# EAGLE design esp32SimpleRelay (EAGLE 8.4.3)
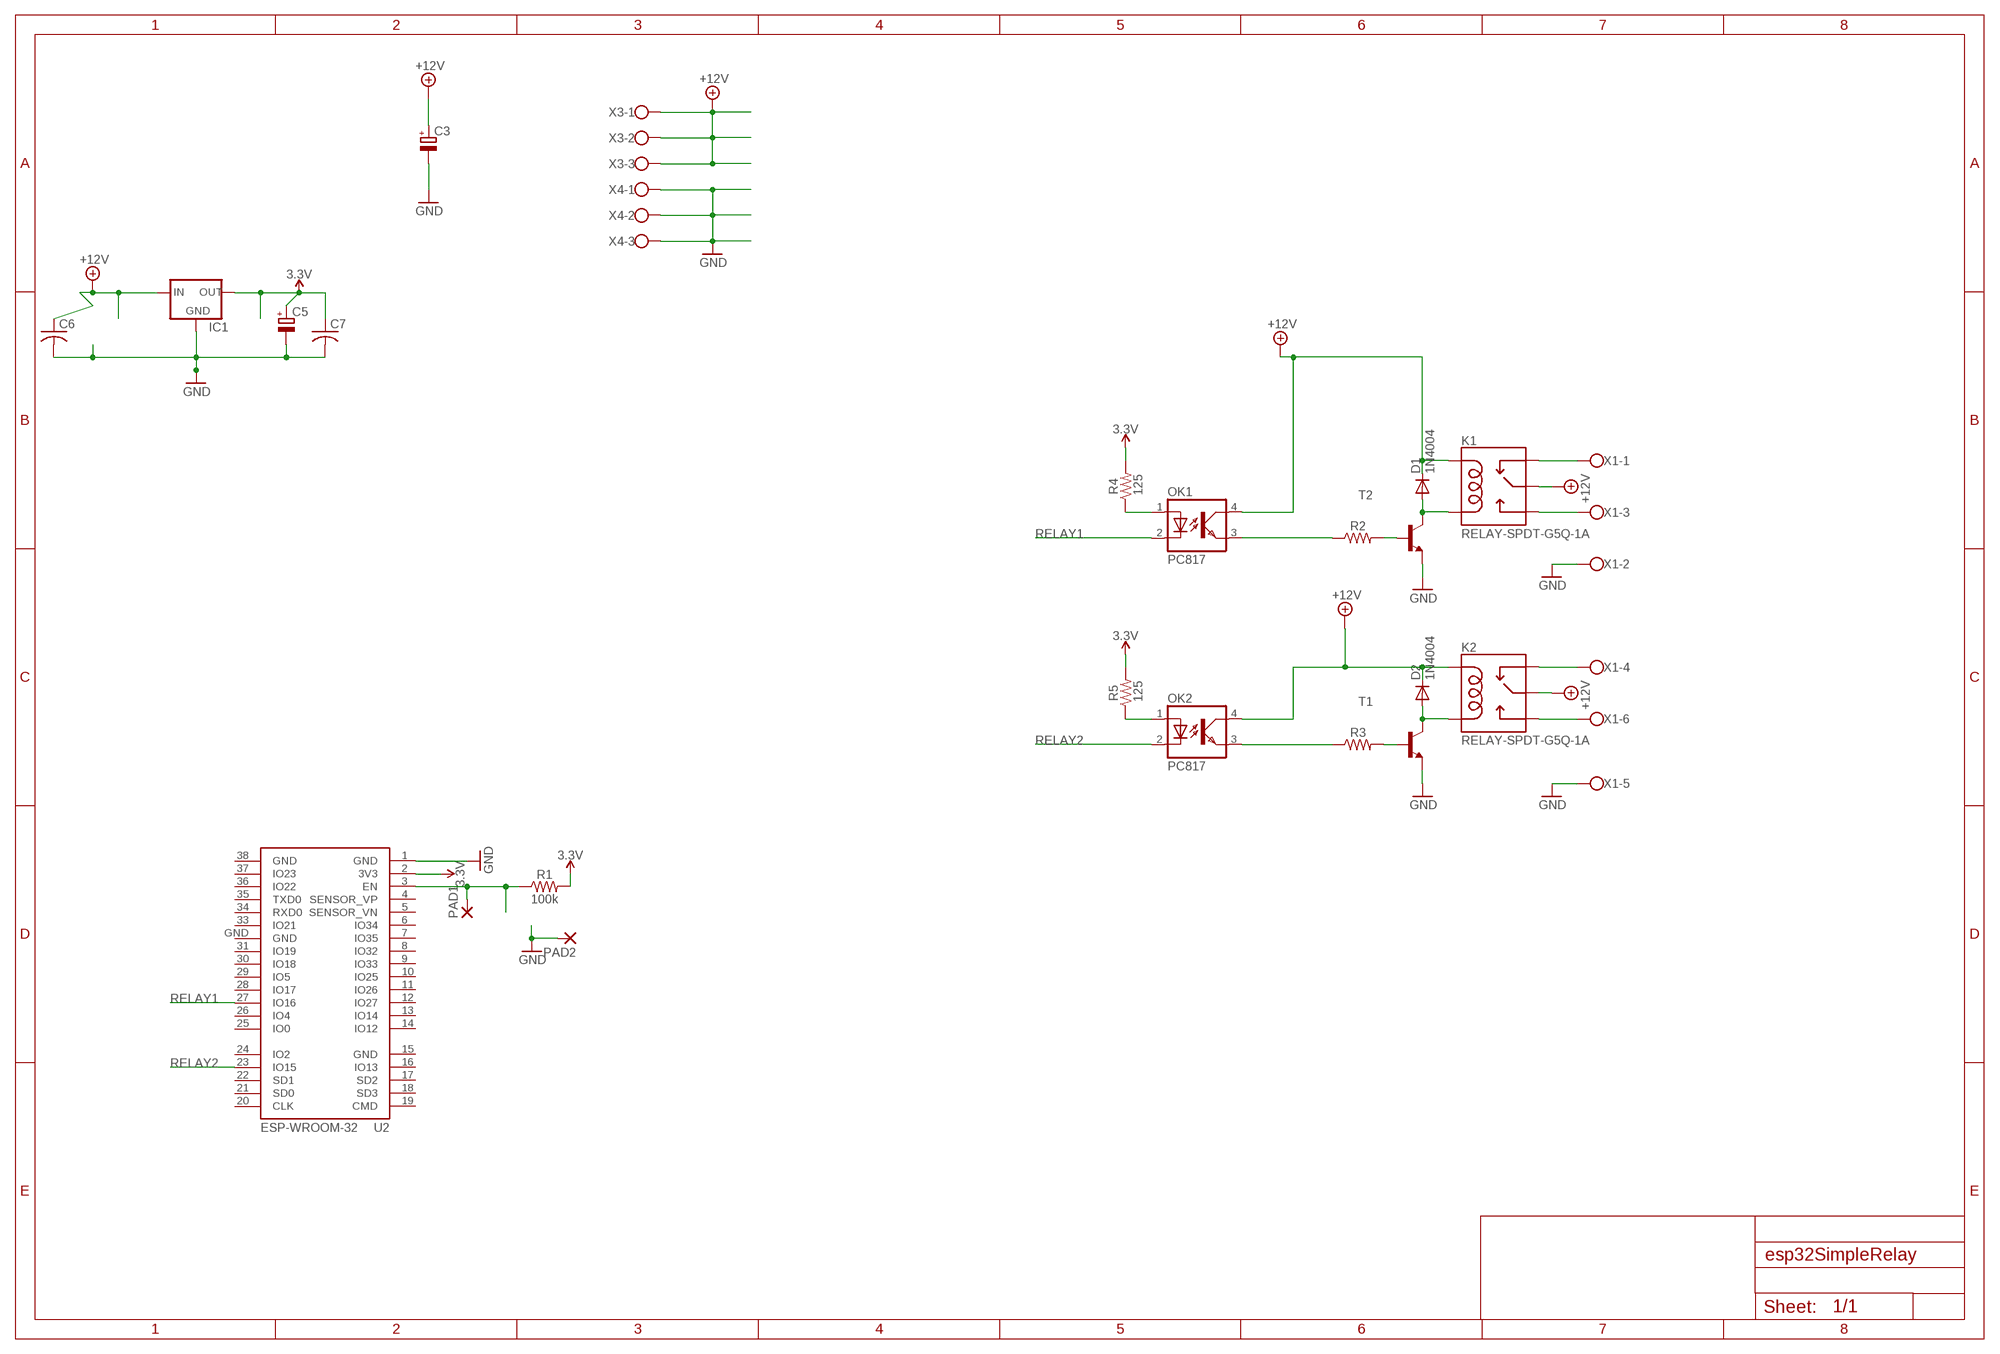
[diagram p0: schematic, sheet 1]

## Parts
C3  CPOL-EUE3.5-8  [E3,5-8]
C5  CPOL-EUE5-6  [E5-6]
C6  C-US050-025X075  [C050-025X075]
C7  C-US050-025X075  [C050-025X075]
D1  1N4004  [DO41-10]
D2  1N4004  [DO41-10]
IC1  78LXX  [78LXX]
K1  RELAY-SPDT-G5Q-1A  [RELAY-G5Q]
K2  RELAY-SPDT-G5Q-1A  [RELAY-G5Q]
OK1  PC817  [DIL04]
OK2  PC817  [DIL04]
PAD1  1,6/0,9  [1,6/0,9]
PAD2  1,6/0,9  [1,6/0,9]
R1  100k  100KOHM-0603-1/10W-1%  [0603]
R2  RESISTORAXIAL-0.3  [AXIAL-0.3]
R3  RESISTORAXIAL-0.3  [AXIAL-0.3]
R4  125  RESISTORAXIAL-0.3  [AXIAL-0.3]
R5  125  RESISTORAXIAL-0.3  [AXIAL-0.3]
T1  -NPN-TO92  [TO92]
T2  -NPN-TO92  [TO92]
U2  ESP-WROOM-32  [ESP-WROOM-32]
X1  W237-6  [W237-6]
X3  W237-103  [W237-103]
X4  W237-103  [W237-103]

## Nets
3.3V: C5.+ C7.1 IC1.OUT R1.2 R4.P$2 R5.P$2 U2.2(3V3)
+12V: C3.+ C6.1 D1.C D2.C IC1.IN K1.2(MAIN) K1.5(COIL1) K2.2(MAIN) K2.5(COIL1) OK1.4(COL) OK2.4(COL) X3.1 X3.2 X3.3
GND: C3.- C5.- C6.2 C7.2 IC1.GND PAD2.1(P) T1.1(E) T2.1(E) U2.1(GND) X1.2 X1.5 X4.1 X4.2 X4.3
N$4: K1.4(NC) X1.1
N$5: K1.3(NO) X1.3
N$6: PAD1.1(P) R1.1 U2.3(EN)
N$7: D1.A K1.1(COIL2) T2.3(C)
N$8: K2.4(NC) X1.4
N$9: D2.A K2.1(COIL2) T1.3(C)
N$10: OK1.1(A) R4.P$1
N$11: K2.3(NO) X1.6
N$12: R2.P$2 T2.2(B)
N$13: OK2.3(EMIT) R3.P$1
N$15: R3.P$2 T1.2(B)
N$16: OK1.3(EMIT) R2.P$1
N$17: OK2.1(A) R5.P$1
RELAY1: OK1.2(C) U2.27(IO16)
RELAY2: OK2.2(C) U2.23(IO15)
Unconnected: U2.4(SENSOR_VP) U2.5(SENSOR_VN) U2.6(IO34) U2.7(IO35) U2.8(IO32) U2.9(IO33) U2.10(IO25) U2.11(IO26) U2.12(IO27) U2.13(IO14) U2.14(IO12) U2.16(IO13) U2.17(SD2) U2.18(SD3) U2.19(CMD) U2.20(CLK) U2.21(SD0) U2.22(SD1) U2.24(IO2) U2.25(IO0) U2.26(IO4) U2.28(IO17) U2.29(IO5) U2.30(IO18) U2.31(IO19) U2.33(IO21) U2.34(RXD0) U2.35(TXD0) U2.36(IO22) U2.37(IO23)

## Power pins joined to a net without a drawn wire
GND: U2.15(GND) U2.38(GND) U2.GND

## Library data of the parts
C3 C5 = resistor:CPOL-EU: POLARIZED CAPACITOR, European symbol
C6 C7 = resistor:C-US: CAPACITOR, American symbol
D1 D2 = diode:1N4004: DIODE general purpose rectifier, 1 A
IC1 = v-reg:78LXX: VOLTAGE REGULATOR
K1 K2 = SparkFun-Retired:RELAY-SPDT: SPDT relay (COM-00101)
OK1 OK2 = optocoupler:PC817: SHARP OPTO COUPLER; MPN: PC817X4J000F; OC_FARNELL: 9707727; OC_NEWARK: 97K7059
PAD1 PAD2 = wirepad:1,6/0,9: THROUGH-HOLE PAD
R1 = SparkFun-Resistors:100KOHM: 100kΩ resistor A resistor is a passive two-terminal electrical component that implements electrical resistance as a circuit element. Resistors act to reduce current flow, and, at the same time, act to lower voltage levels within circuits. - Wikipedia; PROD_ID: RES-07828
R2-R5 = SparkFun-Resistors:RESISTOR: Generic Resistor Package
T1 T2 = transistor-neu-to92:*-NPN-: NPN Transistror
U2 = esp32:ESP-WROOM-32: Espressif Systems ESP-WROOM-32
X1 = con-wago-500:W237-6: WAGO SCREW CLAMP; OC_FARNELL: unknown; OC_NEWARK: unknown
X3 X4 = con-wago-500:W237-103: WAGO SCREW CLAMP; MPN: 237-103; OC_FARNELL: unknown; OC_NEWARK: 18M7116

## Board
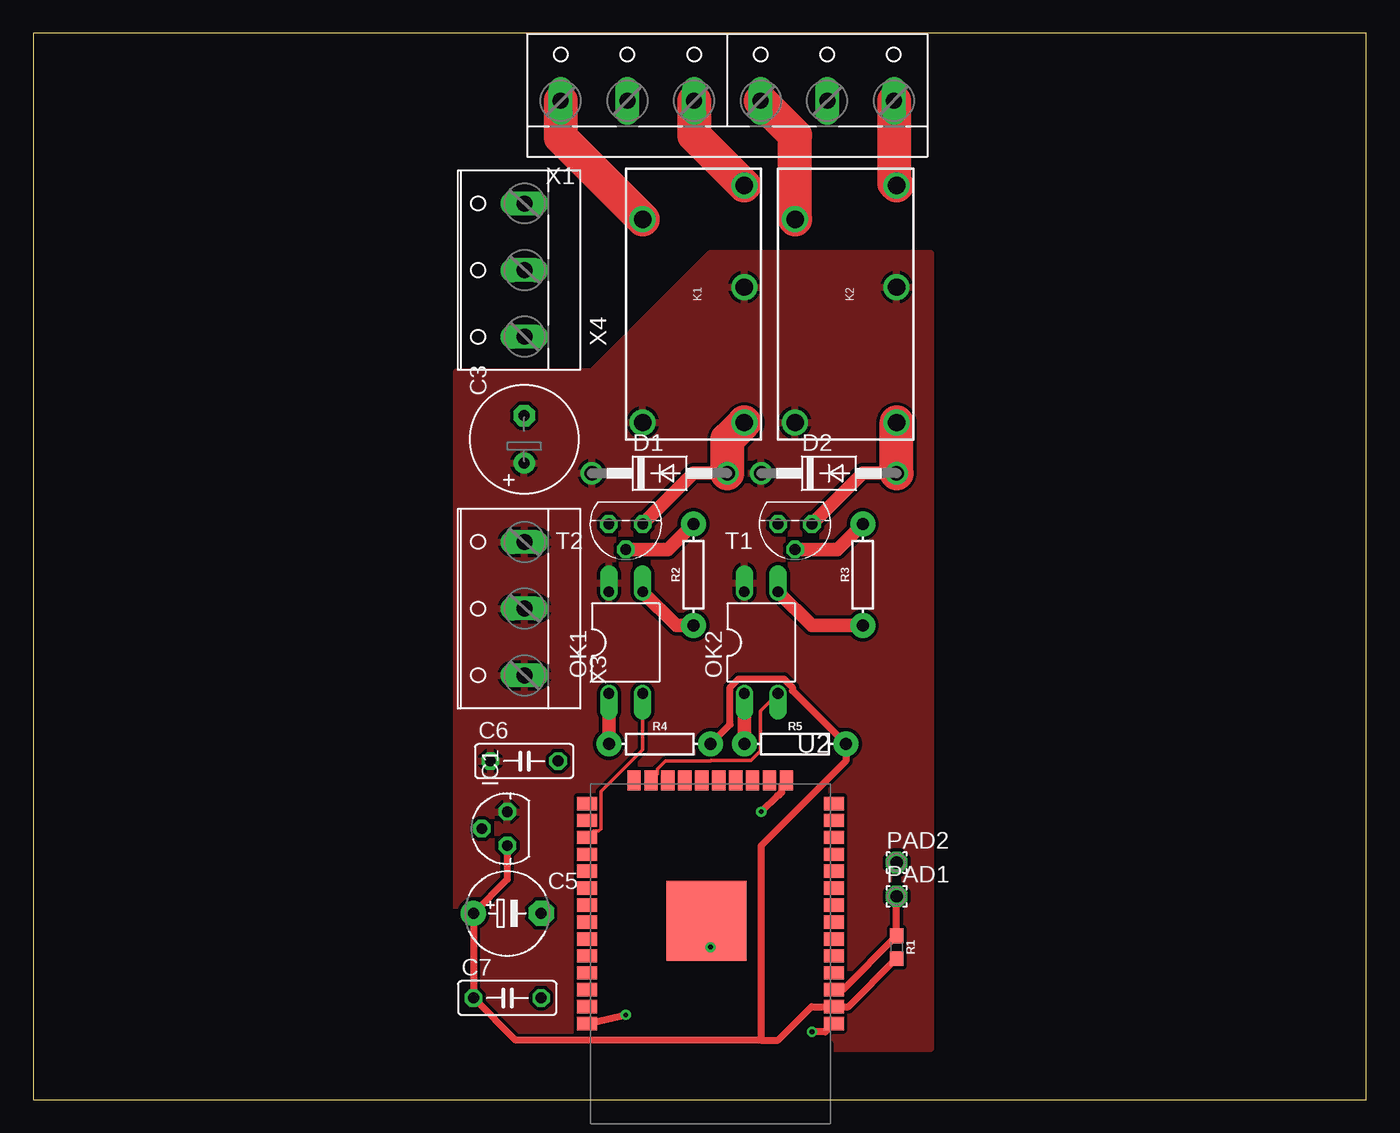
[diagram p1: board, top side]
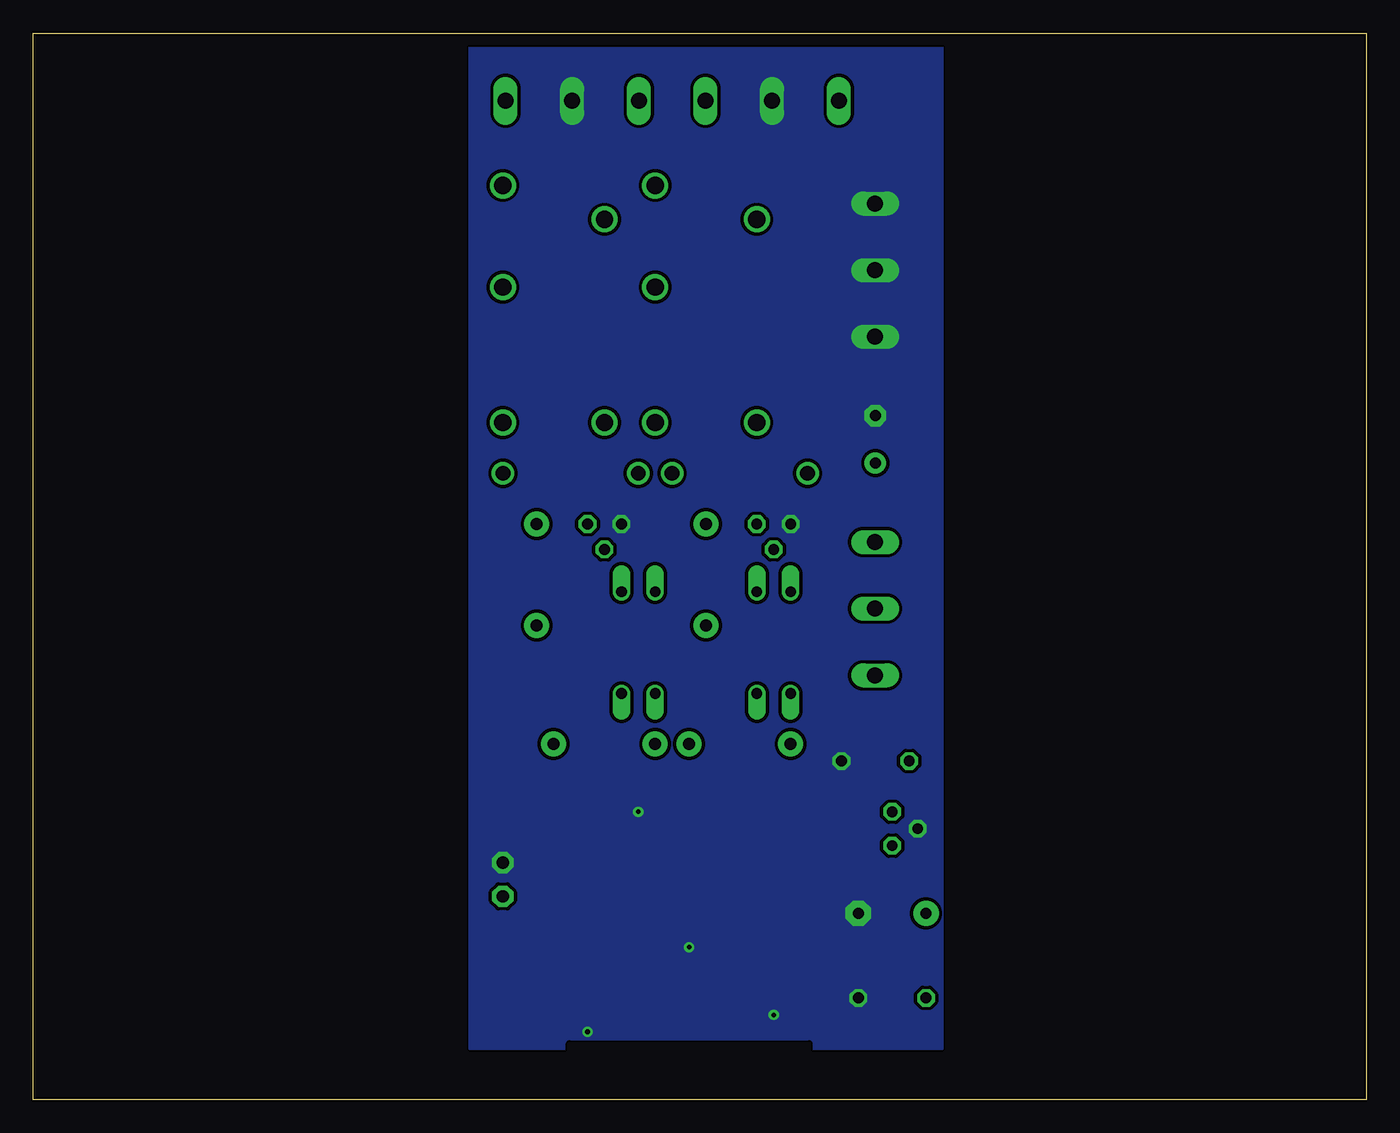
[diagram p2: board, bottom side, seen from below]

Size 100 x 80 mm. Coordinates in mm from the lower left corner, seen from the top.
Outline: 0,0 100,0 100,80 0,80 0,0
Copper layers (1*16): Top 0.035mm / dielectric 1.5mm / Bottom 0.035mm
Design rules "default": minimum track width 6mil, minimum drill 0.35mm, track to track 6mil, track to pad 6mil, pad to pad 6mil, via to via 6mil, smd to smd 6mil, copper to edge 40mil, drill to drill 6mil, minimum pad ring 10mil, minimum via ring 8mil, stop-mask expansion 4mil, vias tented up to drill 0mil, thermal gap 10mil

### Footprints (pad centres in the part's own frame; a part is rotated, then mirrored left to right if it is on the bottom)
E3,5-8 = drill 0.813 pad 1.6: + -1.778,0 | drill 0.813 pad 1.6 octagon: - 1.778,0
E5-6 = drill 0.813 pad 1.905: + -2.54,0 | drill 0.813 pad 1.905 octagon: - 2.54,0
C050-025X075 = drill 0.813 octagon: 1 -2.54,0; 2 2.54,0
DO41-10 = drill 1.118: A 5.08,0; C -5.08,0
78LXX = drill 0.813 octagon: GND 0,1.905; IN 1.27,0; OUT -1.27,0
RELAY-G5Q = drill 1.3: 1 8.89,3.81; 2 -1.27,3.81; 3 -8.89,3.81; 4 -6.35,-3.81; 5 8.89,-3.81
DIL04 = drill 0.813 offset: 1 -1.27,-3.81; 2 1.27,-3.81; 3 1.27,3.81; 4 -1.27,3.81
1,6/0,9 = drill 0.914 pad 1.6 octagon: 1 0,0
0603 = smd 1.1 x 1: 1 -0.85,0; 2 0.85,0
AXIAL-0.3 = drill 0.9 pad 1.88: P$1 -3.81,0; P$2 3.81,0
TO92 = drill 0.813 octagon: 1 1.27,0; 2 0,1.905; 3 -1.27,0
ESP-WROOM-32 = smd 1.5 x 1: 1 -9.25,7; 2 -9.25,5.73; 3 -9.25,4.46; 4 -9.25,3.19; 5 -9.25,1.92; 6 -9.25,0.65; 7 -9.25,-0.62; 8 -9.25,-1.89; 9 -9.25,-3.16; 10 -9.25,-4.43; 11 -9.25,-5.7; 12 -9.25,-6.97; 13 -9.25,-8.24; 14 -9.25,-9.51; 25 9.25,-9.51; 26 9.25,-8.24; 27 9.25,-6.97; 28 9.25,-5.7; 29 9.25,-4.43; 30 9.25,-3.16; 31 9.25,-1.89; 32 9.25,-0.62; 33 9.25,0.65; 34 9.25,1.92; 35 9.25,3.19; 36 9.25,4.46; 37 9.25,5.73; 38 9.25,7 | smd 1 x 1.5: 15 -5.7,-11.25; 16 -4.43,-11.25; 17 -3.16,-11.25; 18 -1.89,-11.25; 19 -0.62,-11.25; 20 0.65,-11.25; 21 1.92,-11.25; 22 3.19,-11.25; 23 4.46,-11.25; 24 5.73,-11.25 | smd 6 x 6: GND 0.3,-0.7
W237-6 = drill 1.194 long: 1 -12.5,-1.27; 2 -7.5,-1.27; 3 -2.5,-1.27; 4 2.5,-1.27; 5 7.5,-1.27; 6 12.5,-1.27
W237-103 = drill 1.194 long: 1 -5,-1.29; 2 0,-1.29; 3 5,-1.29

### Placement (x,y rotation side)
C3  36.83,49.53 90 top
C5  35.56,13.97 0 top
C6  36.83,25.4 0 top
C7  35.56,7.62 0 top
D1  46.99,46.99 0 top
D2  59.69,46.99 0 top
IC1  35.56,20.32 90 top
K1  49.53,59.69 270 top
K2  60.96,59.69 270 top
OK1  44.45,34.29 0 top
OK2  54.61,34.29 0 top
PAD1  64.77,15.24 0 top
PAD2  64.77,17.78 0 top
R1  64.77,11.43 270 top
R2  49.53,39.37 90 top
R3  62.23,39.37 90 top
R4  46.99,26.67 0 top
R5  57.15,26.67 0 top
T1  57.15,43.18 180 top
T2  44.45,43.18 180 top
U2  50.8,12.7 180 top
X1  52.07,76.2 0 top
X3  35.56,36.83 90 top
X4  35.56,62.23 90 top

### Tracks (layer width: path | path; a pad name or v marks a point on that pad's centre or on a via)
3.3V
  Top 0.508: IC1.OUT 35.56,16.51 C5.+ C7.1 36.19,4.45 54.61,4.45 | 54.61,4.45 55.88,4.45 58.4,6.97 U2.2 61.16,6.97 R1.2 | R4.P$2 52.27,28.14 52.27,30.92 52.9,31.55 56.32,31.55 56.95,30.92 56.95,30.68 R5.P$2 60.96,25.4 54.61,19.05 54.61,4.45
+12V
  pour Top (isolate 0.254): 31.75,54.61 41.91,54.61 50.8,63.5 67.31,63.5 67.31,3.81 31.75,3.81
GND  (via drill 0.35)
  Top 0.508: U2.GND 50.5,11.73 v50.8,11.43 | U2.15 56.14,23.59 56.14,23.03 55.9,22.79 55.81,22.79 v54.61,21.59 | U2.38 v44.45,6.35 | U2.1 59.43,5.08 v58.42,5.08
  pour Bottom (isolate 0.254, no thermals): 31.75,80.01 67.31,80.01 67.31,3.81 31.75,3.81
N$4
  Top 2.54: X1.1 39.57,72.19 K1.4
N$5
  Top 2.54: X1.3 49.57,72.35 K1.3
N$6
  Top 0.508: U2.3 60.73,8.24 R1.1 PAD1.1
N$7
  Top 1.016: T2.3 49.53,46.99 D1.A
  Top 2.54: D1.A 52.07,49.53 K1.1
N$8
  Top 2.54: K2.4 57.15,72.35 X1.4
N$9
  Top 1.016: T1.3 62.23,46.99 D2.A
  Top 2.54: D2.A K2.1
N$10
  Top 1.016: OK1.1 R4.P$1
N$11
  Top 2.54: X1.6 64.57,68.78 K2.3
N$12
  Top 1.016: T2.2 47.62,41.27 R2.P$2
N$13
  Top 1.016: R3.P$1 58.42,35.56 OK2.3
N$15
  Top 1.016: T1.2 60.33,41.27 R3.P$2
N$16
  Top 1.016: R2.P$1 48.26,35.56 OK1.3
N$17
  Top 1.016: OK2.1 R5.P$1
RELAY1
  Top 0.254: U2.27 42.04,20.16 42.42,20.16 42.58,20.32 42.58,23.11 45.72,26.25 OK1.2
RELAY2
  Top 0.254: OK2.2 54.56,29.16 54.56,26.16 53.84,25.45 50.85,25.45 50.8,25.4 47.41,25.4 46.83,24.82 46.83,24.44 U2.23